# EAGLE design Laser_Array_CPU_V1.2 (EAGLE 7.7.0)
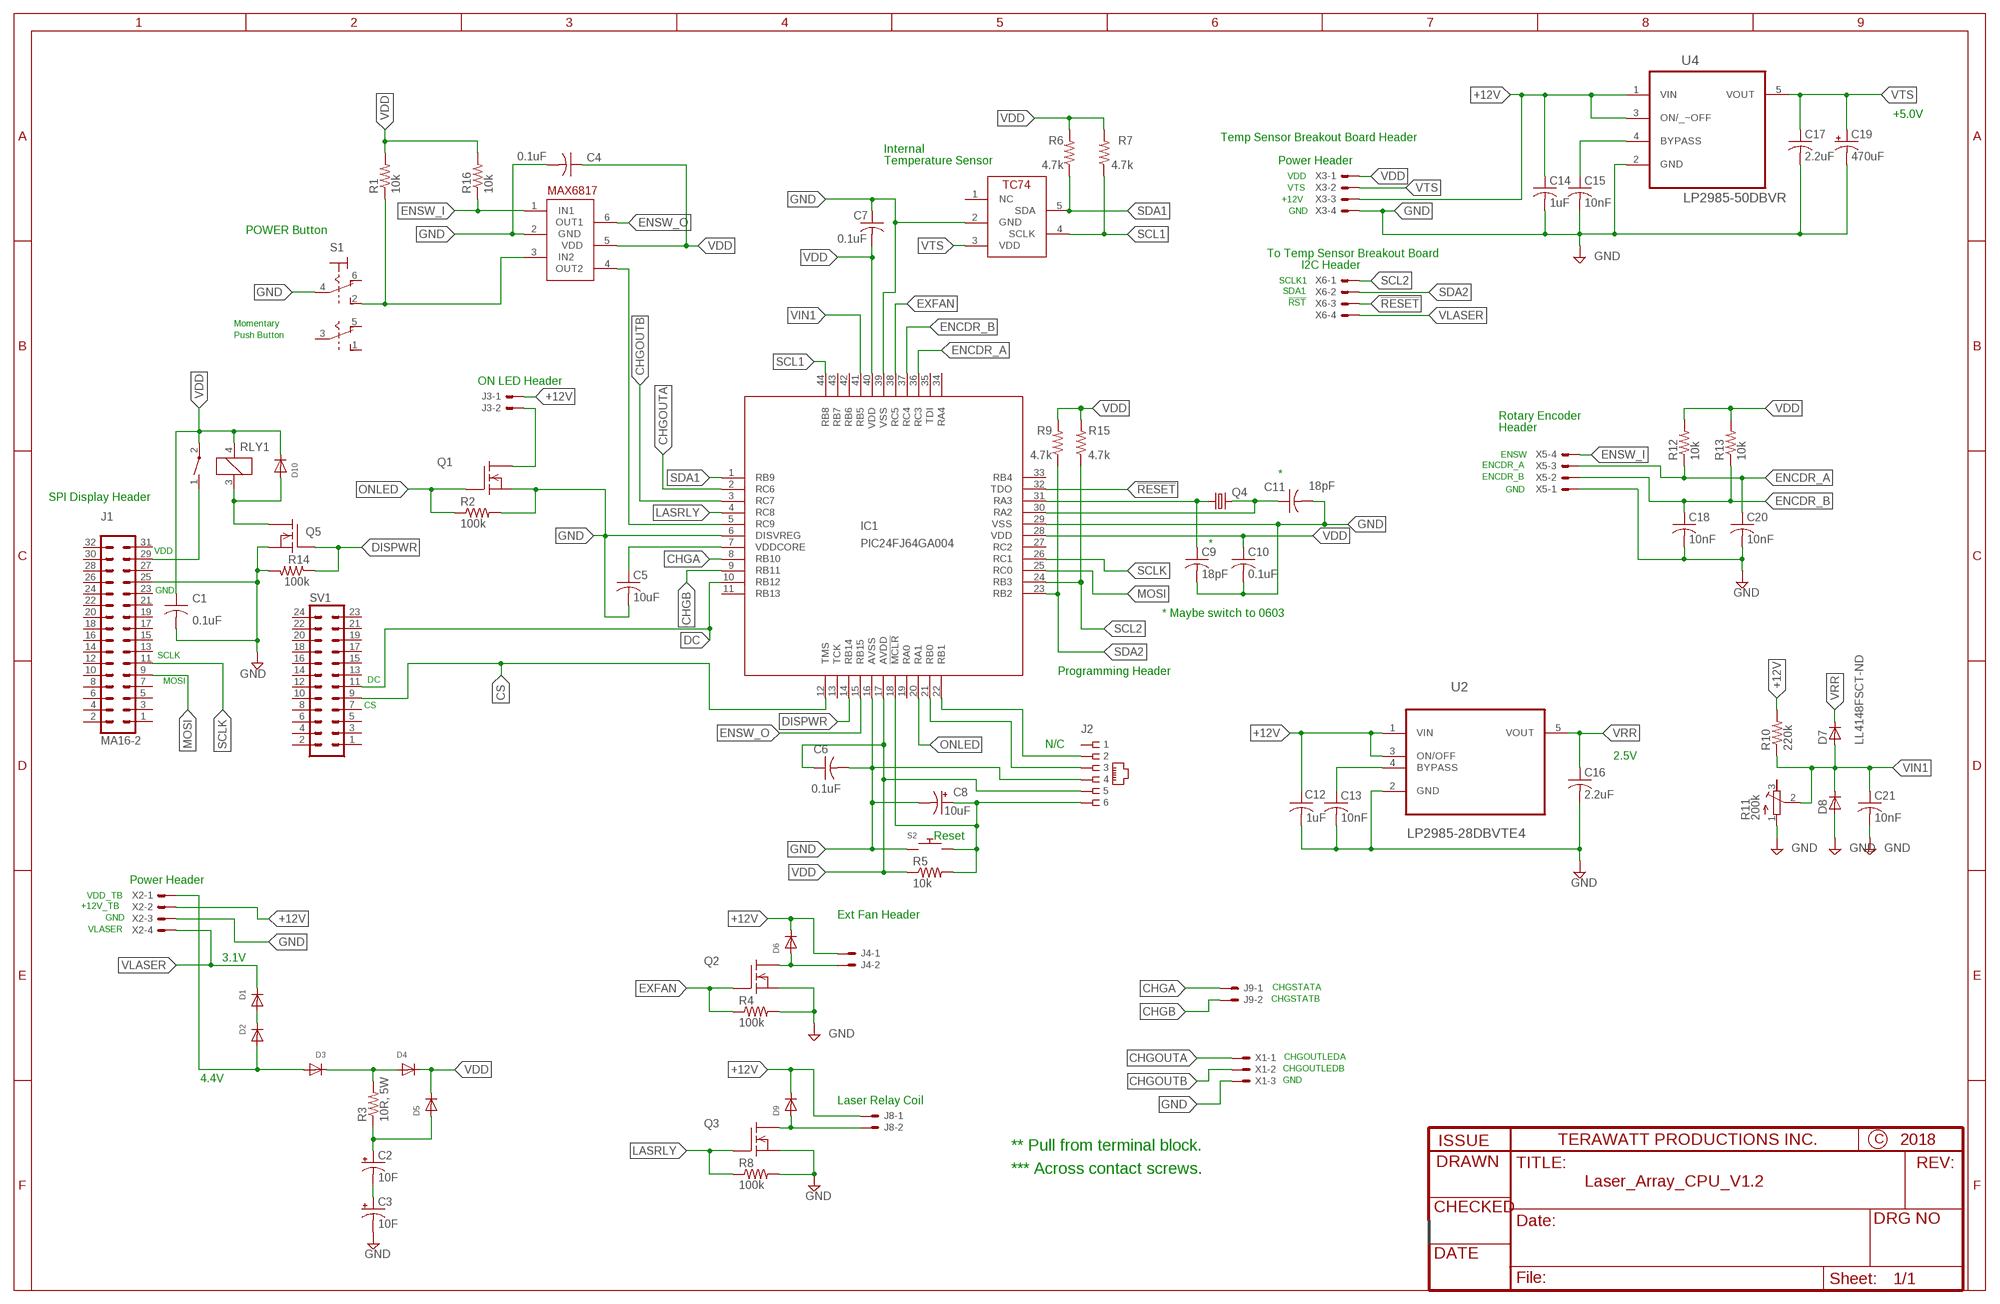
[diagram p0: schematic, sheet 1]

## Parts
C1  0.1uF  C-USC0805  [C0805]
C2  10F  CPOL-USE5-10.5  [E5-10,5]
C3  10F  CPOL-USE5-10.5  [E5-10,5]
C4  0.1uF  C-USC0805  [C0805]
C5  10uF  C-USC0805  [C0805]
C6  0.1uF  C-USC0805  [C0805]
C7  0.1uF  C-USC0805  [C0805]
C8  10uF  CAP3X3  [CAP3X3]
C9  18pF  C-USC0805  [C0805]
C10  0.1uF  C-USC0805  [C0805]
C11  18pF  C-USC0805  [C0805]
C12  1uF  C-USC0805  [C0805]
C13  10nF  C-USC0805  [C0805]
C14  1uF  C-USC0805  [C0805]
C15  10nF  C-USC0805  [C0805]
C16  2.2uF  C-USC0805  [C0805]
C17  2.2uF  C-USC0805  [C0805]
C18  10nF  C-USC0805  [C0805]
C19  470uF  CPOL-USF  [PANASONIC_F]
C20  10nF  C-USC0805  [C0805]
C21  10nF  C-USC0805  [C0805]
D1  S10M-TPMSCT_ND  [S10M-TPMSCT-ND]
D2  S10M-TPMSCT_ND  [S10M-TPMSCT-ND]
D3  S10M-TPMSCT_ND  [S10M-TPMSCT-ND]
D4  DIODE_GENPURP_1A_100V  [DO214AC]
D5  DIODE_GENPURP_1A_100V  [DO214AC]
D6  DIODE_GENPURP_1A_100V  [DO214AC]
D7  LL4148FSCT-ND  D-SOD-80  [SOD80]
D8  LL4148FSCT-ND  D-SOD-80  [SOD80]
D9  DIODE_GENPURP_1A_100V  [DO214AC]
D10  DIODE_GENPURP_1A_100V  [DO214AC]
IC1  PIC24FJ64GA004  [TQFP44]
J1  MA16-2  [MA16-2]
J2  RJ_25  [RJ11-NO_SHIELD]
J3  22-23-2021  [22-23-2021]
J4  22-23-2021  [22-23-2021]
J8  22-23-2021  [22-23-2021]
J9  22-23-2021  [22-23-2021]
Q1  QS5U34CT-ND_MOSFET_N_CHANNEL  [SOT23-5L]
Q2  QS5U34CT-ND_MOSFET_N_CHANNEL  [SOT23-5L]
Q3  QS5U34CT-ND_MOSFET_N_CHANNEL  [SOT23-5L]
Q4  CRYSTALSM49  [SM49]
Q5  QS5U34CT-ND_MOSFET_N_CHANNEL  [SOT23-5L]
R1  10k  R-US_R0805  [R0805]
R2  100k  R-US_R0805  [R0805]
R3  10R, 5W  RESISTOR5W  [RESISTOR5W]
R4  100k  R-US_R0805  [R0805]
R5  10k  R-US_R0805  [R0805]
R6  4.7k  R-US_M0805  [M0805]
R7  4.7k  R-US_M0805  [M0805]
R8  100k  R-US_R0805  [R0805]
R9  4.7k  R-US_M0805  [M0805]
R10  220k  R-US_M0805  [M0805]
R11  200k  R-TRIMM3224X  [RTRIM3224X]
R12  10k  R-US_M0805  [M0805]
R13  10k  R-US_M0805  [M0805]
R14  100k  R-US_R0805  [R0805]
R15  4.7k  R-US_M0805  [M0805]
R16  10k  R-US_R0805  [R0805]
RLY1  RELAY_SPST_1A  [RELAY_SPST_1A]
S1  DPDT_TOGGLE  [22-23-2061]
S2  TACT_PB  [PUSHBUTTON_SMD_SJ]
S3  TC74  [SOT23-5L]
SV1  MA12-2  [MA12-2]
U1  MAX6817  [SOT23-6]
U2  LP2985-28DBVTE4  [SOT95P280X145-5N]
U4  LP2985-50DBVR  [SOT95P280X145-5N]
X1  22-23-2031  [22-23-2031]
X2  22-23-2041  [22-23-2041]
X3  22-23-2041  [22-23-2041]
X5  22-23-2041  [22-23-2041]
X6  22-23-2041  [22-23-2041]

## Nets
!RESET: IC1.32(TDO) X6.3
+12V: C12.1 C14.1 D6.C D9.C J3.1 J4.1 J8.1 R10.2 U2.1(VIN) U2.3(ON/OFF) U4.1(VIN) U4.3(ON/_~OFF) X2.2 X3.3
CHGA: IC1.8(RB10) J9.1
CHGB: IC1.9(RB11) J9.2
CHGOUTA: IC1.2(RC6) X1.1
CHGOUTB: IC1.3(RC7) X1.2
CS: IC1.12(TMS) SV1.9
DC: IC1.10(RB12) SV1.11
DISPWR: IC1.14(RB14) Q5.1(G) R14.1
ENCDR_A: C20.1 IC1.36(RC3) R12.1 X5.3
ENCDR_B: C18.1 IC1.37(RC4) R13.1 X5.2
ENSW_I: R16.1 U1.1(IN1) X5.4
ENSW_O: IC1.15(RB15) U1.6(OUT1)
EXFAN: IC1.38(RC5) Q2.1(G) R4.1
GND: C1.2 C3.- C4.2 C5.2 C6.2 C7.1 C8.- C9.2 C10.2 C11.2 C12.2 C13.2 C14.2 C15.2 C16.2 C17.2 C18.2 C19.- C20.2 C21.2 D8.2(A) IC1.6(DISVREG) IC1.16(AVSS) IC1.29(VSS) IC1.39(VSS) J1.25 J2.4 Q1.2(S) Q2.2(S) Q3.2(S) Q5.2(S) R2.2 R4.2 R8.2 R11.1(A) R14.2 S1.4(P) S2.1 S2.2 S3.2(GND) U1.2(GND) U2.2(GND) U4.2(GND) X1.3 X2.3 X3.4 X5.1
LASRLY: IC1.4(RC8) Q3.1(G) R8.1
MOSI: IC1.25(RC0) J1.9
N$1: C8.+ IC1.18(!MCLR) J2.6 R5.2 S2.3 S2.4
N$2: C5.1 IC1.7(VDDCORE)
N$3: D1.A D2.C
N$4: IC1.22(RB1) J2.2
N$6: C9.1 IC1.31(RA3) Q4.1
N$7: C11.1 IC1.30(RA2) Q4.2
N$8: D10.A Q5.5(D) RLY1.3
N$9: R1.1 S1.2(S) U1.3(IN2)
N$10: IC1.5(RC9) U1.4(OUT2)
N$11: J3.2 Q1.5(D)
N$12: D6.A J4.2 Q2.5(D)
N$13: D9.A J8.2 Q3.5(D)
N$14: J1.29 RLY1.1(S)
N$15: C15.1 U4.4(BYPASS)
N$16: IC1.21(RB0) J2.3
N$33: D3.C D4.A R3.2
N$36: C2.- C3.+
N$37: C2.+ D5.A R3.1
N$55: C13.1 U2.4(BYPASS)
ONLED: IC1.20(RA1) Q1.1(G) R2.1
SCL1: IC1.44(RB8) R7.1 S3.4(SCLK)
SCL2: IC1.24(RB3) R15.1 X6.1
SCLK: IC1.26(RC1) J1.11
SDA1: IC1.1(RB9) R6.1 S3.5(SDA)
SDA2: IC1.23(RB2) R9.1 X6.2
VDD: C1.1 C4.1 C6.1 C7.2 C10.1 D4.C D5.C D10.C IC1.17(AVDD) IC1.28(VDD) IC1.40(VDD) J2.5 R1.2 R5.1 R6.2 R7.2 R9.2 R12.2 R13.2 R15.2 R16.2 RLY1.2(P) RLY1.4 U1.5(VDD) X3.1
VDD_TB: D2.A D3.A X2.1
VIN1: C21.1 D7.2(A) D8.1(C) IC1.41(RB5) R10.1 R11.2(S)
VLASER: D1.C X2.4 X6.4
VRR: C16.1 D7.1(C) U2.5(VOUT)
VTS: C17.1 C19.+ S3.3(VDD) U4.5(VOUT) X3.2
Unconnected: IC1.11(RB13) IC1.13(TCK) IC1.19(RA0) IC1.27(RC2) IC1.33(RB4) IC1.34(RA4) IC1.35(TDI) IC1.42(RB6) IC1.43(RB7) J1.1 J1.2 J1.3 J1.4 J1.5 J1.6 J1.7 J1.8 J1.10 J1.12 J1.13 J1.14 J1.15 J1.16 J1.17 J1.18 J1.19 J1.20 J1.21 J1.22 J1.23 J1.24 J1.26 J1.27 J1.28 J1.30 J1.31 J1.32 J2.1 R11.3(E) S1.1(S1) S1.3(P1) S1.5(O1) S1.6(O) S3.1(NC) SV1.1 SV1.2 SV1.3 SV1.4 SV1.5 SV1.6 SV1.7 SV1.8 SV1.10 SV1.12 SV1.13 SV1.14 SV1.15 SV1.16 SV1.17 SV1.18 SV1.19 SV1.20 SV1.21 SV1.22 SV1.23 SV1.24

## Notes on the sheet
- +5.0V
- Temp Sensor Breakout Board Header
- Internal
- Temperature Sensor | Power Header
- VDD
- VTS
- +12V
- GND
- POWER Button
- To Temp Sensor Breakout Board
- I2C Header
- SCLK1
- SDA1
- !RST
- Momentary
- Push Button
- ON LED Header
- Rotary Encoder
- Header
- ENSW
- ENCDR_A
- * | ENCDR_B
- GND
- SPI Display Header
- *
- VDD
- GND
- * Maybe switch to 0603
- SCLK
- Programming Header
- MOSI | DC
- CS
- N/C
- 2.5V
- Reset
- Power Header
- VDD_TB
- +12V_TB
- GND | Ext Fan Header
- VLASER
- 3.1V
- CHGSTATA
- CHGSTATB
- CHGOUTLEDA
- CHGOUTLEDB
- 4.4V | GND
- Laser Relay Coil
- ** Pull from terminal block.
- *** Across contact screws.

## Library data of the parts
C1 C4-C7 C9-C18 C20 C21 = rcl:C-US: CAPACITOR, American symbol
C2 C3 C19 = rcl:CPOL-US: POLARIZED CAPACITOR, American symbol
C8 = Mine:CAP3X3: capacitor - electrolytic This is from the Nichicon 3mm series
D1-D3 = Mine:S10M-TPMSCT_ND
D4-D6 D9 D10 = Mine:DIODE_GENPURP_1A_100V
D7 D8 = semicon-smd-ipc:D-: DIODE unfilled
IC1 = microchip:PIC24FJ64GA004: PIC24FJ64GA004 edit this description Auto generated by make-symbol-device-package-bsdl.ulp Rev. 25 Source: PIC24FJ64GA004.bsd; MPN: PIC24FJ64GA004-E/PT; OC_FARNELL: 1332299; OC_NEWARK: 98M1927
J1 = Mine:MA16-2
J2 = Mine:RJ_25: RJ_25 Package: RJ_25 through hole Digikey Part # A311422-ND
J3 J4 J8 J9 = Mine:22-23-2021: .100" (2.54mm) Center Header - 2 Pin; MF: MOLEX; MPN: 22-23-2021; OC_FARNELL: 1462926; OC_NEWARK: 25C3832
Q1-Q3 Q5 = Mine:QS5U34CT-ND_MOSFET_N_CHANNEL: QS5U34CT-ND Enhancement mode, N-channel MOSFET Package: SOT 23-5
Q4 = adafruit:CRYSTAL: CRYSTAL; OC_FARNELL: unknown; OC_NEWARK: unknown
R1 R2 R4-R10 R12-R16 = rcl:R-US_: RESISTOR, American symbol
R3 = Mine:RESISTOR5W: 5W SMD resistor, uses standard 5W through hole resistor.
R11 = rcl:R-TRIMM: Trimm resistor
RLY1 = Mine:RELAY_SPST_1A: RELAY_SPST_1A, DK# Z1230-ND, based on OMRONG6S pkg.
S1 = Mine:DPDT_TOGGLE
S2 = Mine:TACT_PB: Surfacemount tactile push button 6mm body Digikeyn part£:n CKN9085ct-nd
S3 = Mine:TC74
SV1 = con-lstb:MA12-2: PIN HEADER; OC_FARNELL: unknown; OC_NEWARK: unknown
U1 = Mine:MAX6817: MAX6817 2 channel CMOS switch debouncer Package SOT 23-6
U2 = Texas Instruments_By_element14_Batch_1:LP2985-28DBVTE4: LOW-NOISE LOW-DROPOUT REGULATOR WITH SHUTDOWN; MPN: LP2985-28DBVTE4; OC_FARNELL: 1053676; OC_NEWARK: 97K3681; PACKAGE: SOT-23-5; SUPPLIER: Texas Instruments
U4 = Texas Instruments_By_element14_Batch_1:LP2985-50DBVR: 150-mA LOW-NOISE LOW-DROPOUT REGULATOR WITH SHUTDOWN; MPN: LP2985-33DBVT; OC_FARNELL: -; OC_NEWARK: 43J9347; PACKAGE: SOT-23-5; SUPPLIER: Texas Instruments
X1 = Mine:22-23-2031: .100" (2.54mm) Center Header - 3 Pin; MF: MOLEX; MPN: 22-23-2031; OC_FARNELL: 1462950; OC_NEWARK: 30C0862
X2 X3 X5 X6 = Mine:22-23-2041: .100" (2.54mm) Center Header - 4 Pin; MF: MOLEX; MPN: 22-23-2041; OC_FARNELL: 1462920; OC_NEWARK: 38C0355

## Net classes
0 default: width 0.254 mm, drill 0.508 mm, clearance 0.203 mm

## Board
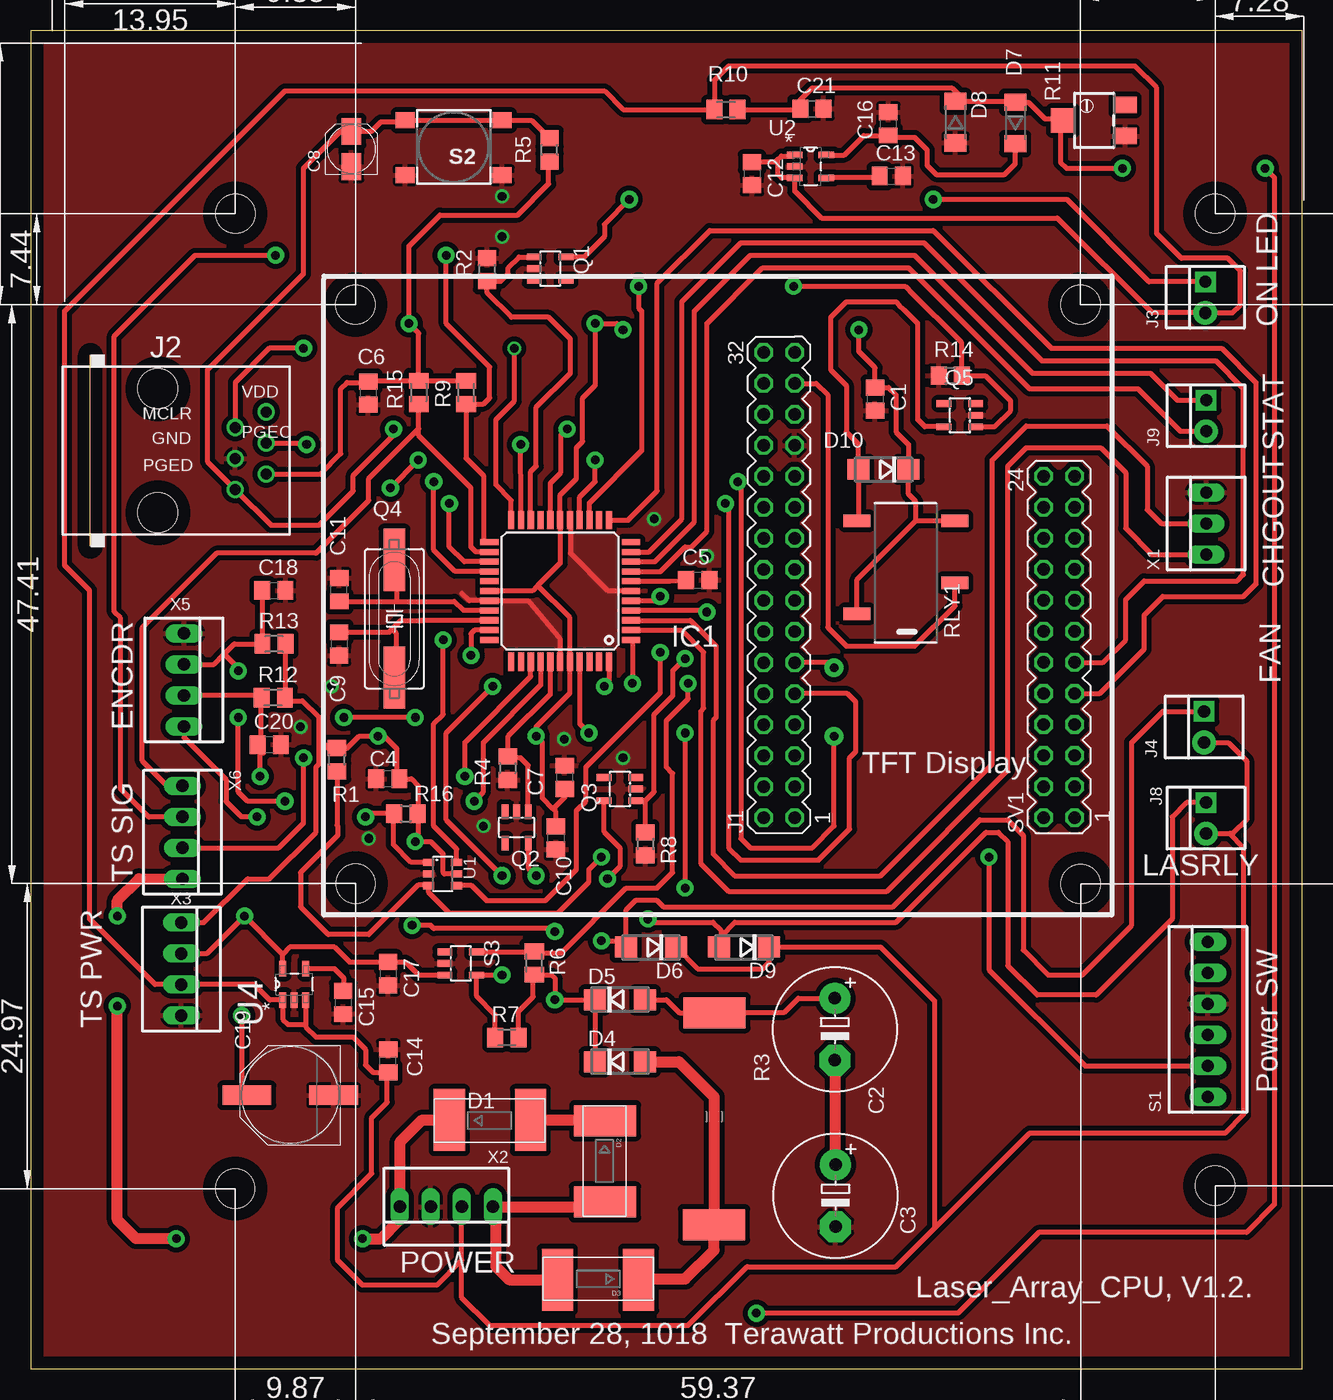
[diagram p1: board, top side]
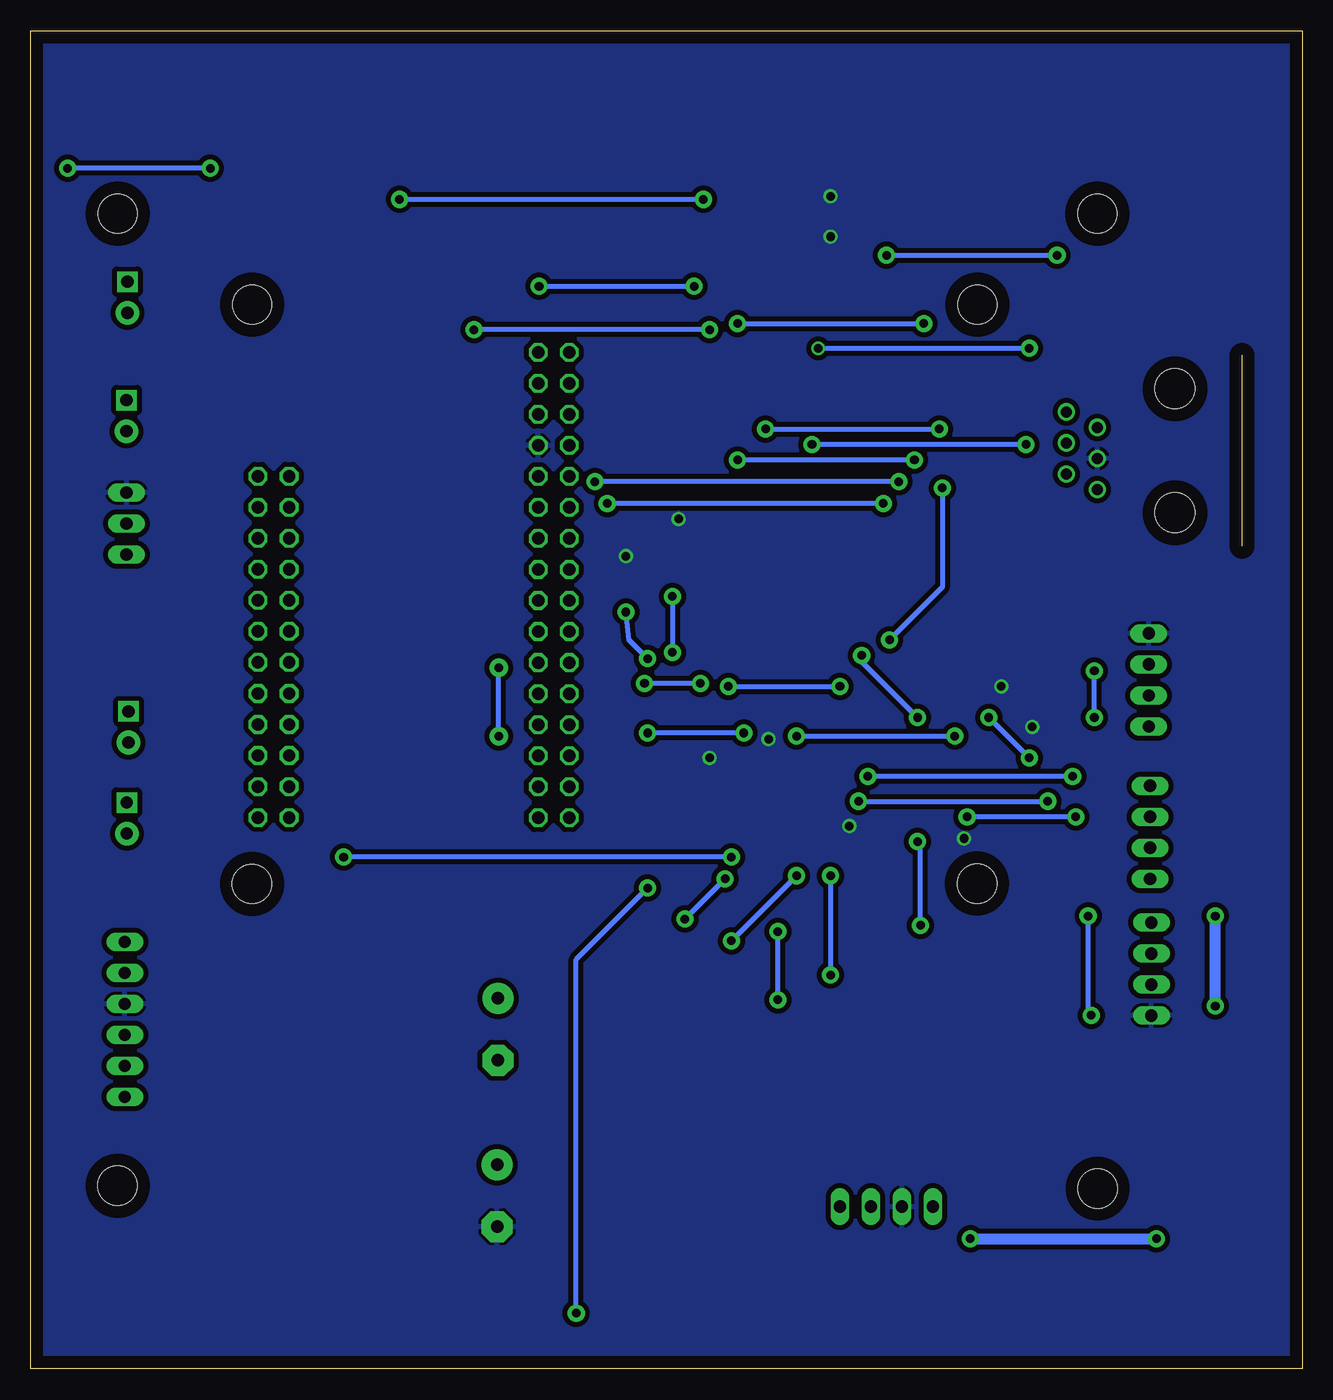
[diagram p2: board, bottom side, seen from below]

Size 104.12 x 109.59 mm. Coordinates in mm from the lower left corner, seen from the top.
Outline: 0,0 104.12,0 104.12,109.59 0,109.59 0,0
Copper layers (1*16): Top 0.035mm / dielectric 1.5mm / Bottom 0.035mm
Design rules "default *": minimum track width 10mil, minimum drill 24mil, track to track 16mil, track to pad 14mil, pad to pad 14mil, via to via 14mil, smd to smd 14mil, copper to edge 40mil, drill to drill 8mil, minimum pad ring 10mil, minimum via ring 8mil, stop-mask expansion 4mil, vias tented up to drill 0mil, thermal gap 10mil
Holes 3.2 mm at 26.6,87.15 85.97,87.15 26.62,39.74 85.99,39.72 16.75,14.77 97,15.01 16.77,94.59 96.99,94.6

### Footprints (pad centres in the part's own frame; a part is rotated, then mirrored left to right if it is on the bottom)
C0805 = smd 1.3 x 1.5: 1 -0.95,0; 2 0.95,0
E5-10,5 = drill 1.016 pad 2.54: + -2.54,0 | drill 1.016 pad 2.54 octagon: - 2.54,0
CAP3X3 = smd 2.2 x 1.6: + 1.45,0; - -1.425,0
PANASONIC_F = smd 4 x 1.6: + 3.55,0; - -3.55,0
S10M-TPMSCT-ND = smd 2.54 x 5.08: A 4.106,0.05; C -2.54,0.055
DO214AC = smd 1.8 x 1.7: A 2.05,0; C -2.05,0
SOD80 = smd 1.4 x 1.8: 1 -1.7,0; 2 1.7,0
TQFP44 = smd 1.5 x 0.5: 1 -5.8,4; 2 -5.8,3.2; 3 -5.8,2.4; 4 -5.8,1.6; 5 -5.8,0.8; 6 -5.8,0; 7 -5.8,-0.8; 8 -5.8,-1.6; 9 -5.8,-2.4; 10 -5.8,-3.2; 11 -5.8,-4; 23 5.8,-4; 24 5.8,-3.2; 25 5.8,-2.4; 26 5.8,-1.6; 27 5.8,-0.8; 28 5.8,0; 29 5.8,0.8; 30 5.8,1.6; 31 5.8,2.4; 32 5.8,3.2; 33 5.8,4 | smd 0.5 x 1.5: 12 -4,-5.8; 13 -3.2,-5.8; 14 -2.4,-5.8; 15 -1.6,-5.8; 16 -0.8,-5.8; 17 0,-5.8; 18 0.8,-5.8; 19 1.6,-5.8; 20 2.4,-5.8; 21 3.2,-5.8; 22 4,-5.8; 34 4,5.8; 35 3.2,5.8; 36 2.4,5.8; 37 1.6,5.8; 38 0.8,5.8; 39 0,5.8; 40 -0.8,5.8; 41 -1.6,5.8; 42 -2.4,5.8; 43 -3.2,5.8; 44 -4,5.8
MA16-2 = drill 1.016 octagon: 1 -20.32,-1.27; 2 -20.32,1.27; 3 -17.78,-1.27; 4 -17.78,1.27; 5 -15.24,-1.27; 6 -15.24,1.27; 7 -12.7,-1.27; 8 -12.7,1.27; 9 -10.16,-1.27; 10 -10.16,1.27; 11 -7.62,-1.27; 12 -7.62,1.27; 13 -5.08,-1.27; 14 -5.08,1.27; 15 -2.54,-1.27; 16 -2.54,1.27; 17 0,-1.27; 18 0,1.27; 19 2.54,-1.27; 20 2.54,1.27; 21 5.08,-1.27; 22 5.08,1.27; 23 7.62,-1.27; 24 7.62,1.27; 25 10.16,-1.27; 26 10.16,1.27; 27 12.7,-1.27; 28 12.7,1.27; 29 15.24,-1.27; 30 15.24,1.27; 31 17.78,-1.27; 32 17.78,1.27
RJ11-NO_SHIELD = drill 0.9 pad 1.4: 1 -3.175,8.89; 2 -1.905,6.35; 3 -0.635,8.89; 4 0.635,6.35; 5 1.905,8.89; 6 3.175,6.35 | hole 3.251: -5.08,0; 5.08,0
22-23-2021 = drill 1 pad 1.93: 1 -1.27,0 | drill 1 pad 1.676 square: 2 1.27,0
SOT23-5L = smd 0.55 x 1.2: 1 -0.95,-1.3; 2 0,-1.3; 3 0.95,-1.3; 4 0.95,1.3; 5 -0.95,1.3
SM49 = smd 5.08 x 1.778: 1 -4.826,0; 2 4.826,0
R0805 = smd 1.3 x 1.5: 1 -0.95,0; 2 0.95,0
RESISTOR5W = smd 2.54 x 5.08: 1 -4,-0.95; 2 13.34,-1
M0805 = smd 1.3 x 1.6: 1 -0.95,0; 2 0.95,0
RTRIM3224X = smd 1.32 x 1.9: 1 -1.27,-2.54; 3 1.27,-2.54 | smd 2 x 2: 2 0,2.54
RELAY_SPST_1A = smd 1 x 2.2: 1 1.88,-5.825; 2 6.96,-5.825; 3 6.96,2.175; 4 -0.66,2.175
22-23-2061 = drill 1 long: 1 -6.35,0; 2 -3.81,0; 3 -1.27,0; 4 1.27,0; 5 3.81,0; 6 6.35,0
PUSHBUTTON_SMD_SJ = smd 1.55 x 1.3: 1 -3.865,2.205; 2 4.085,2.205; 3 -3.865,-2.295; 4 4.085,-2.295
MA12-2 = drill 1.016 octagon: 1 -13.97,-1.27; 2 -13.97,1.27; 3 -11.43,-1.27; 4 -11.43,1.27; 5 -8.89,-1.27; 6 -8.89,1.27; 7 -6.35,-1.27; 8 -6.35,1.27; 9 -3.81,-1.27; 10 -3.81,1.27; 11 -1.27,-1.27; 12 -1.27,1.27; 13 1.27,-1.27; 14 1.27,1.27; 15 3.81,-1.27; 16 3.81,1.27; 17 6.35,-1.27; 18 6.35,1.27; 19 8.89,-1.27; 20 8.89,1.27; 21 11.43,-1.27; 22 11.43,1.27; 23 13.97,-1.27; 24 13.97,1.27
SOT23-6 = smd 0.6 x 0.9: 1 -0.95,-1.15; 2 0,-1.15; 3 0.95,-1.15; 4 0.95,1.15; 5 0,1.15; 6 -0.95,1.15
SOT95P280X145-5N = smd 1.27 x 0.559: 1 -1.295,0.94; 2 -1.295,0; 3 -1.295,-0.94; 4 1.295,-0.94; 5 1.295,0.94
22-23-2031 = drill 1 long: 1 -2.54,0; 2 0,0; 3 2.54,0
22-23-2041 = drill 1 long: 1 -3.81,0; 2 -1.27,0; 3 1.27,0; 4 3.81,0

### Placement (x,y rotation side)
C1  69.15,79.42 270 top
C2  65.86,27.82 270 top
C3  65.91,14.19 270 top
C4  29.25,48.32 180 top
C5  54.63,64.59 0 top
C6  27.65,79.9 270 top
C7  43.73,48.44 270 top
C8  26.27,99.88 90 top
C9  25.26,59.37 270 top
C10  43.01,43.48 270 top
C11  25.28,63.8 90 top
C12  59.08,97.86 270 top
C13  70.48,97.67 0 top
C14  29.29,25.22 90 top
C15  25.59,30 270 top
C16  70.23,101.95 90 top
C17  29.27,32.36 270 top
C18  19.92,63.75 0 top
C19  21.27,22.41 180 top
C20  19.55,51.12 0 top
C21  63.98,103.19 0 top
D1  36.83,20.34 0 top
D2  46.99,17.78 270 top
D3  47.24,7.37 180 top
D4  48.26,25.15 0 top
D5  48.26,30.23 0 top
D6  50.8,34.55 180 top
D7  80.63,102.02 90 top
D8  75.74,102.09 270 top
D9  58.42,34.55 180 top
D10  69.85,73.66 180 top
IC1  43.36,63.7 180 top
J1  61.29,65.46 90 top
J2  10.41,75.19 270 top
J3  96.19,87.75 90 top
J4  96.09,52.56 90 top
J8  96.24,45.11 90 top
J9  96.26,78.05 90 top
Q1  42.55,90.1 270 top
Q2  39.8,44.34 180 top
Q3  48.26,47.49 90 top
Q4  29.8,61.43 90 top
Q5  76.09,78.09 90 top
R1  25.1,49.88 90 top
R2  37.38,90 90 top
R3  56.96,25.16 270 top
R4  39.07,49.19 270 top
R5  42.49,99.81 90 top
R6  41.24,33.23 270 top
R7  39,27.14 0 top
R8  50.33,42.99 270 top
R9  35.66,79.96 90 top
R10  56.94,103.12 180 top
R11  87.09,102.23 90 top
R12  19.88,54.96 0 top
R13  19.93,59.36 0 top
R14  75.31,81.33 180 top
R15  31.78,79.96 90 top
R16  30.73,45.47 0 top
RLY1  69.85,62.49 90 top
S1  96.4,28.62 90 top
S2  34.75,99.95 180 top
S3  35.22,33.2 270 top
SV1  84.22,59.12 90 top
U1  33.75,40.53 270 top
U2  63.87,98.46 0 top
U4  21.59,31.5 90 top
X1  96.26,69.22 90 top
X2  34.04,13.29 180 top
X3  12.34,32.74 270 top
X5  12.56,56.42 270 top
X6  12.45,43.94 270 top

### Tracks (layer width: path | path; a pad name or v marks a point on that pad's centre or on a via)
!RESET  (via drill 0.7 pad 1.4)
  Top 0.406: IC1.32 36.37,60.5 36.07,60.2 v36.07,58.42 | v31.5,53.34 v25.65,53.34 | X6.3 20.32,42.67 22.35,44.71 v22.35,50.04
  Bottom 0.406: v25.65,53.34 v22.35,50.04 | v31.5,53.34 36.07,57.91 v36.07,58.42
+12V
  Top 0.406: 61.21,99.06 61.21,97.79 61.47,97.54 62.56,97.54 U2.3 62.58,96.43 64.77,94.24 84.07,94.24 91.83,86.48 J3.1 98.41,86.48 99.06,87.12 99.06,89.92 98.04,90.93 94.23,90.93 92.2,92.97 92.2,104.9 90.42,106.68 57.15,106.68 55.99,105.52 R10.2 48.52,103.12 46.99,104.65 20.83,104.65 2.79,86.62 2.79,65.79 4.83,63.76 4.83,36.83 10.19,31.47 X3.3 | 61.21,99.06 61.47,99.32 62.49,99.32 U2.1 | 61.21,99.06 60.96,98.81 C12.1 | X3.3 12.37,31.5 | 35.31,8.9 33.27,6.86 27.18,6.86 25.15,8.89 25.15,13.21 27.94,16 27.94,20.58 29.21,21.85 29.21,24.19 C14.1 28.05,24.27 27.43,24.89 27.43,26.16 26.42,27.18 23.37,27.18 22.53,28.02 22.53,28.2 | 35.31,8.9 X2.2 | 35.31,8.9 35.31,5.84 37.59,3.56 53.85,3.56 58.67,8.38 70.87,8.38 74.04,11.56 | D6.C 54.63,32.77 59.94,32.77 60.47,33.29 D9.C 69.6,34.55 74.04,30.1 74.04,11.56 | J4.1 98.06,51.29 99.57,49.79 99.57,44.96 98.44,43.84 98.15,43.84 | 74.04,11.56 81.79,19.31 97.79,19.31 99.31,20.83 99.31,42.67 98.15,43.84 | J8.1 98.15,43.84 | X3.3 18.32,31.47 19.58,30.2 U4.1 20.65,28.63 21.08,28.2 22.53,28.2 | U4.3 22.53,28.2
CHGA
  Top 0.406: IC1.8 49.18,65.28 51.56,65.28 53.59,67.31 54.1,67.31 55.37,68.58 55.37,85.6 59.94,90.17 71.88,90.17 73.15,88.9 74.68,87.38 81.79,80.27 90.68,80.27 94.16,76.78 J9.1
CHGB
  Top 0.406: IC1.9 51.11,66.1 54.36,69.34 54.36,86.62 58.93,91.19 72.39,91.19 73.66,89.92 74.3,89.28 82.04,81.54 91.69,81.54 93.91,79.32 J9.2
CHGOUTA
  Top 0.406: IC1.2 53.29,60.5 55.12,58.68 55.12,54.1 54.86,53.85 54.86,41.4 57.15,39.12 70.1,39.12 80.01,49.02 80.01,73.92 81.53,75.44 87.63,75.44 89.66,73.41 89.66,68.84 91.82,66.68 X1.1
CHGOUTB
  Top 0.406: IC1.3 54.02,61.3 56.13,59.18 56.13,53.34 55.88,53.09 55.88,42.17 57.66,40.39 69.6,40.39 78.74,49.53 78.74,74.42 81.53,77.22 88.14,77.22 91.44,73.92 91.44,70.36 92.58,69.22 X1.2
CS
  Top 0.406: IC1.12 48.92,69.5 51.31,71.88 51.31,88.9 55.63,93.22 73.91,93.22 83.57,83.57 97.54,83.57 100.33,80.77 100.33,64.26 99.31,63.25 92.71,63.25 91.19,61.72 91.19,58.93 87.56,55.31 SV1.9
DC
  Top 0.406: IC1.10 50.64,66.9 53.34,69.6 53.34,87.38 58.17,92.2 73.15,92.2 82.8,82.55 97.03,82.55 99.31,80.27 99.31,65.03 98.81,64.52 91.19,64.52 89.66,62.99 89.66,59.69 87.82,57.85 SV1.11
DISPWR  (via drill 0.7 pad 1.4)
  Top 0.406: 45.72,69.54 IC1.14 45.76,70.91 50.04,75.19 50.04,86.62 49.78,86.87 v49.78,88.65 | Q5.1 78.92,77.14 80.26,78.49 80.26,79.25 78.23,81.28 76.31,81.28 R14.1 76.2,81.39 76.2,84.08 72.01,88.27 71.88,88.39 71.63,88.65 v62.48,88.65
  Bottom 0.406: v62.48,88.65 v49.78,88.65
ENCDR_A  (via drill 0.7 pad 1.4)
  Top 0.406: X5.3 18.74,55.15 R12.1 18.86,54.89 18.86,50.87 C20.1 | IC1.36 40.96,56.71 35.56,51.31 v35.56,48.52 | C20.1 19.05,50.42 | v18.8,48.52 18.8,50.42 C20.1
  Bottom 0.406: v18.8,48.52 v35.56,48.52
ENCDR_B  (via drill 0.7 pad 1.4)
  Top 0.406: X5.2 15.02,57.69 15.88,58.55 | 15.88,58.55 16.69,59.36 R13.1 18.98,63.74 C18.1 | v20.83,46.48 17.78,46.48 17.02,47.25 v17.02,53.34 | v17.02,57.15 17.02,57.41 15.88,58.55 | v36.32,46.48 37.08,47.25 37.08,51.31 41.76,55.99 IC1.37
  Bottom 0.406: v36.32,46.48 v20.83,46.48 | v17.02,53.34 v17.02,57.15
ENSW_I  (via drill 0.7 pad 1.4)
  Top 0.406: X5.4 12.56,51.7 16,48.26 16,46.48 17.27,45.21 v18.54,45.21 | v27.43,45.21 27.69,45.47 R16.1 29.72,45.4 29.72,42.93 31.17,41.48 U1.1
  Bottom 0.406: v18.54,45.21 v27.43,45.21
ENSW_O  (via drill 0.7 pad 1.4)
  Top 0.406: v33.78,59.69 33.78,53.6 33.02,52.83 33.02,44.45 34.9,42.57 U1.6 | IC1.15 44.96,71.38 46.23,72.65 v46.23,74.42 | v29.46,72.14 v31.75,74.42
  Bottom 0.406: v31.75,74.42 v46.23,74.42 | v29.46,72.14 29.46,64.01 v33.78,59.69
EXFAN
  Top 0.406: IC1.38 42.56,55.26 39.12,51.82 39.12,50.18 R4.1 39.17,50.04 40.13,50.04 40.75,49.42 Q2.1
GND  (via drill 0.7 pad 1.14)
  Top 0.406: 49.22,63.76 IC1.6 49.1,63.76 47.24,63.76 44.2,66.8 44.2,69.46 IC1.16 | IC1.39 43.36,59.77 40.73,62.9 IC1.29 35.91,62.9 35.31,63.5
  other vias: 27.69,43.44 43.69,51.56 22.1,52.58 24.64,55.88 38.61,96.01 38.61,92.71 51.05,69.6 55.37,66.55 37.08,44.45 48.51,50.04
  pour Top: 0.25,109.84 104.39,109.59 104.39,-0.24 0.25,0.01
  pour Bottom: 0.25,109.59 104.86,109.59 105.11,-0.5 0.51,-0.5
LASRLY  (via drill 0.7 pad 1.4)
  Top 0.406: v55.37,61.98 55,62.1 IC1.4 | v53.59,58.17 52.58,57.15 52.58,55.12 51.05,53.6 51.05,47.25 50.34,46.54 | 49.61,46.48 Q3.1 50.34,46.54 | R8.1 50.33,46.53 50.34,46.54
  Bottom 0.406: v53.59,58.17 55.12,59.69 v55.37,61.98
MOSI  (via drill 0.7 pad 1.4)
  Top 0.406: IC1.25 35.5,66.1 34.29,67.31 v34.29,70.87 | J1.9 66.88,55.3 67.56,54.61 67.56,50.55 67.06,50.04 67.06,44.2 64.52,41.66 58.17,41.66 57.15,42.67 57.15,70.61 v56.9,70.87
  Bottom 0.406: v34.29,70.87 v56.9,70.87
N$1  (via drill 0.7 pad 1.4)
  Top 0.406: R5.2 41.01,102.24 S2.3 S2.4 30.54,102.11 28.7,102.11 27.92,101.33 C8.+ 25.38,101.33 22.35,98.3 22.35,89.66 14.48,81.79 14.48,74.3 J2.6 19.68,69.09 23.62,69.09 26.42,71.88 26.42,73.15 29.72,76.46 v29.72,76.96 | IC1.18 42.56,72.53 43.43,73.41 43.43,76.46 v43.94,76.96
  Bottom 0.406: v43.94,76.96 v29.72,76.96
N$2
  Top 0.406: IC1.7 52.32,64.5 C5.1
N$3
  Top 0.889: D1.A 46.98,20.39 D2.C
N$4  (via drill 0.7, 0.7 pad 1.4)
  Top 0.406: IC1.22 39.36,71.13 38.1,72.39 38.1,74.93 38.1,75.95 38.1,77.73 39.62,79.25 v39.62,83.57 | v22.35,83.57 19.56,83.57 16.76,80.77 J2.2
  Bottom 0.406: v39.62,83.57 v22.35,83.57
N$6
  Top 0.406: IC1.31 32.26,61.3 | 32.26,61.3 32,61.3 | C9.1 29.33,60.32 29.59,60.58 | 29.59,60.58 30.31,61.3 32.26,61.3 | Q4.1 29.97,56.78 29.97,60.2 29.59,60.58
N$7
  Top 0.406: C11.1 29.97,62.85 | 29.97,62.85 34.68,62.85 35.44,62.1 IC1.30 | Q4.2 29.97,66.08 29.97,62.85
N$8
  Top 0.406: RLY1.3 67.82,69.59 67.82,73.64 D10.A 67.8,75.71 66.8,76.71 66.8,80.52 65.53,81.79 65.53,86.11 66.8,87.38 70.87,87.38 71.12,87.12 71.5,86.74 72.64,85.6 72.64,77.73 73.23,77.14 Q5.5
N$9  (via drill 0.7 pad 1.4)
  Top 0.406: S1.2 86.36,24.81 78.49,32.68 v78.49,41.91 | 32.6,39.54 U1.3 32.55,39.63 | v46.74,41.91 45.72,40.9 45.72,39.88 43.18,37.34 34.29,37.34 32.6,39.03 32.6,39.54 | R1.1 25.1,44.5 25.15,44.45 25.15,43.69 22.1,40.64 22.1,37.85 22.86,37.09 24.13,35.82 24.38,35.56 27.69,35.56 31.75,39.63 32.51,39.63 32.6,39.54
  Bottom 0.406: v46.74,41.91 v78.49,41.91
N$10  (via drill 0.7 pad 1.4)
  Top 0.406: IC1.5 51.21,62.9 v51.56,63.25 | U1.4 34.95,39.63 36.07,39.63 37.34,38.36 42.16,38.36 44.7,40.9 44.7,45.72 44.96,45.98 45.09,46.1 45.47,46.48 45.47,49.28 51.56,55.37 v51.56,58.68
  Bottom 0.406: v51.56,63.25 v51.56,58.68
N$11  (via drill 0.7 pad 1.4)
  Top 0.406: v73.91,95.76 84.84,95.76 91.58,89.02 J3.2 | v49.02,95.76 46.99,93.73 46.99,92.71 45.32,91.05 Q1.5
  Bottom 0.406: v73.91,95.76 v49.02,95.76
N$12  (via drill 0.7 pad 1.4)
  Top 0.406: J4.2 92.69,53.83 90.17,51.31 90.17,36.32 86.11,32.26 83.31,32.26 81.28,34.29 81.28,43.69 80.01,44.96 77.72,44.96 70.61,37.85 51.82,37.85 51.31,38.36 49.53,38.36 48.77,37.59 48.77,34.56 D6.A 48.24,35.05 v46.74,35.05 | Q2.5 40.75,41.04 v41.4,40.39
  Bottom 0.406: v41.4,40.39 v46.74,35.05
N$13  (via drill 0.7 pad 1.4)
  Top 0.406: 56.39,34.56 D9.A 56.13,34.78 56.13,35.05 56.52,35.44 | J8.2 94.63,46.38 93.47,45.21 93.47,36.83 87.25,30.61 82.42,30.61 80.01,33.02 80.01,43.18 79.25,43.94 78.23,43.94 70.87,36.58 57.66,36.58 56.52,35.44 | v50.55,36.83 50.8,36.58 55.88,36.58 56.52,35.94 56.52,35.44 | v47.24,40.13 48.26,41.15 48.26,42.67 46.96,43.98 Q3.5
  Bottom 0.406: v47.24,40.13 v50.55,36.83
N$14
  Top 0.406: 62.63,80.77 J1.29 64.34,80.7 65.28,79.76 65.28,60.71 66.8,59.18 72.39,59.18 75.69,62.49 75.69,64.35 RLY1.1
N$15
  Top 0.406: U4.4 24.87,32.79 25.65,32.01 25.65,31.02 C15.1
N$16  (via drill 0.7 pad 1.4, 0.71 pad 1.4)
  Top 0.406: IC1.21 40.16,70.84 v40.13,75.69 | J2.3 22.48,75.82 v22.61,75.69
  Bottom 0.406: v22.61,75.69 v40.13,75.69
N$33
  Top 0.889: D4.A 53.09,25.15 55.96,22.27 55.96,12.45 R3.2 55.96,9.74 53.59,7.37 49.84,7.37 D3.C
N$36
  Top 0.356: 65.86,16.78 C3.+
  Top 0.889: C2.- 65.86,16.78
N$37
  Top 0.406: D5.A 52.07,30.23 53.14,29.16 R3.1 56.06,29.21 61.72,29.21 62.87,30.36 C2.+
N$55
  Top 0.406: C13.1 69.38,97.52 U2.4
ONLED
  Top 0.406: IC1.20 40.96,73.47 41.4,73.92 41.4,78.74 44.2,81.54 44.2,84.33 42.42,86.11 39.37,86.11 37.38,88.1 R2.1 38.51,89.05 39.12,89.66 39.12,90.17 39.99,91.05 Q1.1
SCL1  (via drill 0.7 pad 1.4)
  Top 0.406: R7.1 38.05,29.01 36.52,30.53 S3.4 36.53,32.26 v38.61,32.26 | IC1.44 47.36,56.25 v46.99,55.88 | v38.61,40.39 34.04,44.96 34.04,52.07 v37.85,55.88
  Bottom 0.406: v46.99,55.88 v37.85,55.88 | v38.61,40.39 v38.61,32.26
SCL2
  Top 0.406: 31.75,78.98 R15.1 31.78,76.99 | IC1.24 36.48,66.9 36.07,67.31 36.07,72.14 31.78,76.43 31.78,76.99 | X6.1 12.45,47.73 11.2,47.73 9.14,49.79 9.14,60.71 15.24,66.8 23.37,66.8 27.69,71.12 27.69,72.9 31.78,76.99
SCLK  (via drill 0.7 pad 1.4, 0.7 pad 1.52)
  Top 0.406: v33.02,72.65 33.02,67.06 34.78,65.3 IC1.26 | v57.91,72.65 58.17,72.39 58.17,43.44 58.93,42.67 64.01,42.67 65.79,44.45 v65.79,51.82 | v65.79,57.41 65.35,57.84 J1.11
  Bottom 0.406: v33.02,72.65 v57.91,72.65 | v65.79,51.82 v65.79,57.41
SDA1  (via drill 0.7 pad 1.4)
  Top 0.406: IC1.1 49.28,59.58 v49.28,56.14 | S3.5 41.21,34.15 R6.1 41.39,34.04 43.43,34.04 48.77,39.37 51.31,39.37 52.58,40.64 52.58,48.77 52.07,49.28 52.07,53.09 52.2,53.22 53.85,54.87 v53.85,56.14
  Bottom 0.406: v49.28,56.14 v53.85,56.14
SDA2  (via drill 0.7 pad 1.4)
  Top 0.406: IC1.23 37.2,67.7 37.08,67.82 37.08,73.15 35.66,74.58 R9.1 37.09,79.01 37.59,79.5 37.59,82.04 34.04,85.6 v34.04,91.19 | X6.2 9.68,45.21 9.68,45.19 7.37,47.5 7.37,61.47 6.86,61.98 6.86,84.58 13.46,91.19 v20.07,91.19
  Bottom 0.406: v34.04,91.19 v20.07,91.19
VDD  (via drill 0.7 pad 1.4)
  Top 0.406: R13.2 20.83,59.31 R12.2 21.08,54.71 22.25,54.71 23.62,53.34 23.62,51.56 | R9.2 35.56,80.75 | R15.2 27.96,80.91 27.71,80.65 C6.1 27.57,80.77 25.91,80.77 25.4,80.27 25.4,74.93 23.75,73.28 J2.5 | R15.2 R9.2 | 35.56,81.01 R9.2 | R15.2 31.78,84.81 v30.99,85.6 30.99,91.95 33.53,94.49 39.88,94.49 42.42,97.03 42.42,98.79 R5.1 | 41.53,64.14 43.36,65.97 IC1.17 43.36,71.56 44.7,72.9 44.7,75.44 45.21,75.95 45.21,79.5 46.23,80.52 v46.23,85.6 48.01,85.6 v48.51,85.09 | 41.53,64.14 41.09,63.7 IC1.28 | 41.53,64.14 44.16,61.51 IC1.40 44.16,55.34 41.4,52.58 v41.4,51.82 41.91,51.31 41.91,46.74 42.8,45.85 | R7.2 39.95,29.28 41.15,30.48 41.15,32.19 R6.2 41.27,32.26 42.67,32.26 42.93,32.01 v42.93,30.23 D5.C D4.C | v42.93,35.82 42.67,36.07 33.02,36.07 32.77,36.32 v31.24,36.32 | X3.1 14.2,36.55 17.78,40.13 19.56,40.13 23.37,43.94 23.37,49.28 23.62,49.53 23.62,51.56 | RLY1.4 67.68,64.63 72.49,69.45 | 72.49,69.45 RLY1.2 | v67.82,85.09 67.82,83.31 69.15,81.98 C1.1 70.26,80.37 70.87,79.76 70.87,76.71 71.88,75.69 71.88,73.64 | 72.49,69.45 72.49,71.02 71.88,71.63 71.88,73.64 | 71.88,73.64 D10.C | 23.62,51.56 24.35,50.83 R1.2 25.94,50.83 26.92,51.82 v28.45,51.82 28.96,51.82 30,50.77 30,48.52 C4.1 31.18,48.32 31.75,47.75 31.75,45.53 R16.2 31.75,45.4 31.75,43.44 v31.5,43.18 32.77,43.18 33.78,42.17 33.78,40.64 33.9,40.53 U1.5 | C10.1 43.01,45.64 42.8,45.85 | C7.2 43.73,46.78 42.8,45.85
  Bottom 0.406: v46.23,85.6 v30.99,85.6 | v42.93,30.23 v42.93,35.82 | v41.4,51.82 v28.45,51.82 | v48.51,85.09 v67.82,85.09 | v31.24,36.32 31.24,42.93 v31.5,43.18
VDD_TB
  Top 0.889: D2.A 46.65,13.29 X2.1 38.1,13.04 38.1,8.38 39.17,7.32 D3.A
VIN1  (via drill 0.7 pad 1.4)
  Top 0.406: R10.1 62.96,103.12 C21.1 63.03,103.93 64.01,104.9 75.44,104.9 75.95,104.4 75.95,103.99 D8.1 80.56,103.79 D7.2 81.7,103.72 83.06,102.36 84.41,102.36 R11.2 84.33,102.01 84.33,98.81 84.84,98.3 v89.41,98.3 | IC1.41 44.96,52.83 v45.72,52.07 | v53.59,52.07 v53.59,39.37 | v101.09,98.3 101.85,97.54 101.85,13.46 99.57,11.18 82.55,11.18 75.95,4.57 v59.44,4.57
  Bottom 0.406: v45.72,52.07 v53.59,52.07 | v89.41,98.3 v101.09,98.3 | v59.44,4.57 59.44,33.53 v53.59,39.37
VLASER  (via drill 0.7 pad 1.4)
  Top 0.813: 30.23,18.54
  Top 0.889: 30.23,18.54 32.08,20.39 D1.C | v7.11,29.72 7.11,12.19 8.64,10.67 v11.94,10.67 | v7.11,37.09 7.11,38.36 8.89,40.13 X6.4 | 30.23,18.54 X2.4 30.23,12.2 28.7,10.67 v27.18,10.67
  Bottom 0.889: v27.18,10.67 v11.94,10.67 | v7.11,29.72 v7.11,37.09
VRR
  Top 0.406: U2.5 66.63,99.4 68.23,101 C16.1 70.39,100.84 72.39,100.84 73.41,99.82 73.41,98.55 74.17,97.79 79.76,97.79 80.63,98.67 D7.1
VTS  (via drill 0.7 pad 1.4)
  Top 0.406: v17.27,28.96 17.27,22.86 C19.+ | S3.3 31.76,32.25 30.7,33.31 C17.1 26.12,33.31 24.89,34.55 21.23,34.55 20.65,33.96 | X3.2 12.37,34.04 14.48,34.04 v17.53,37.09 20.65,33.96 | U4.5 20.65,33.96
  Bottom 0.406: v17.27,28.96 17.53,29.21 v17.53,37.09

### Text on the board
tPlace: ON LED | VDD | MCLR | GND | PGEC | STAT | PGED | CHGOUT | FAN | ENCDR | TFT Display | LASRLY | TS SIG | TS PWR | Power SW | POWER | Laser_Array_CPU, V1.2. | September 28, 1018 Terawatt Productions Inc.